# EAGLE schematic Phoenix_industries_95-134708-01 (EAGLE 8.3.2)
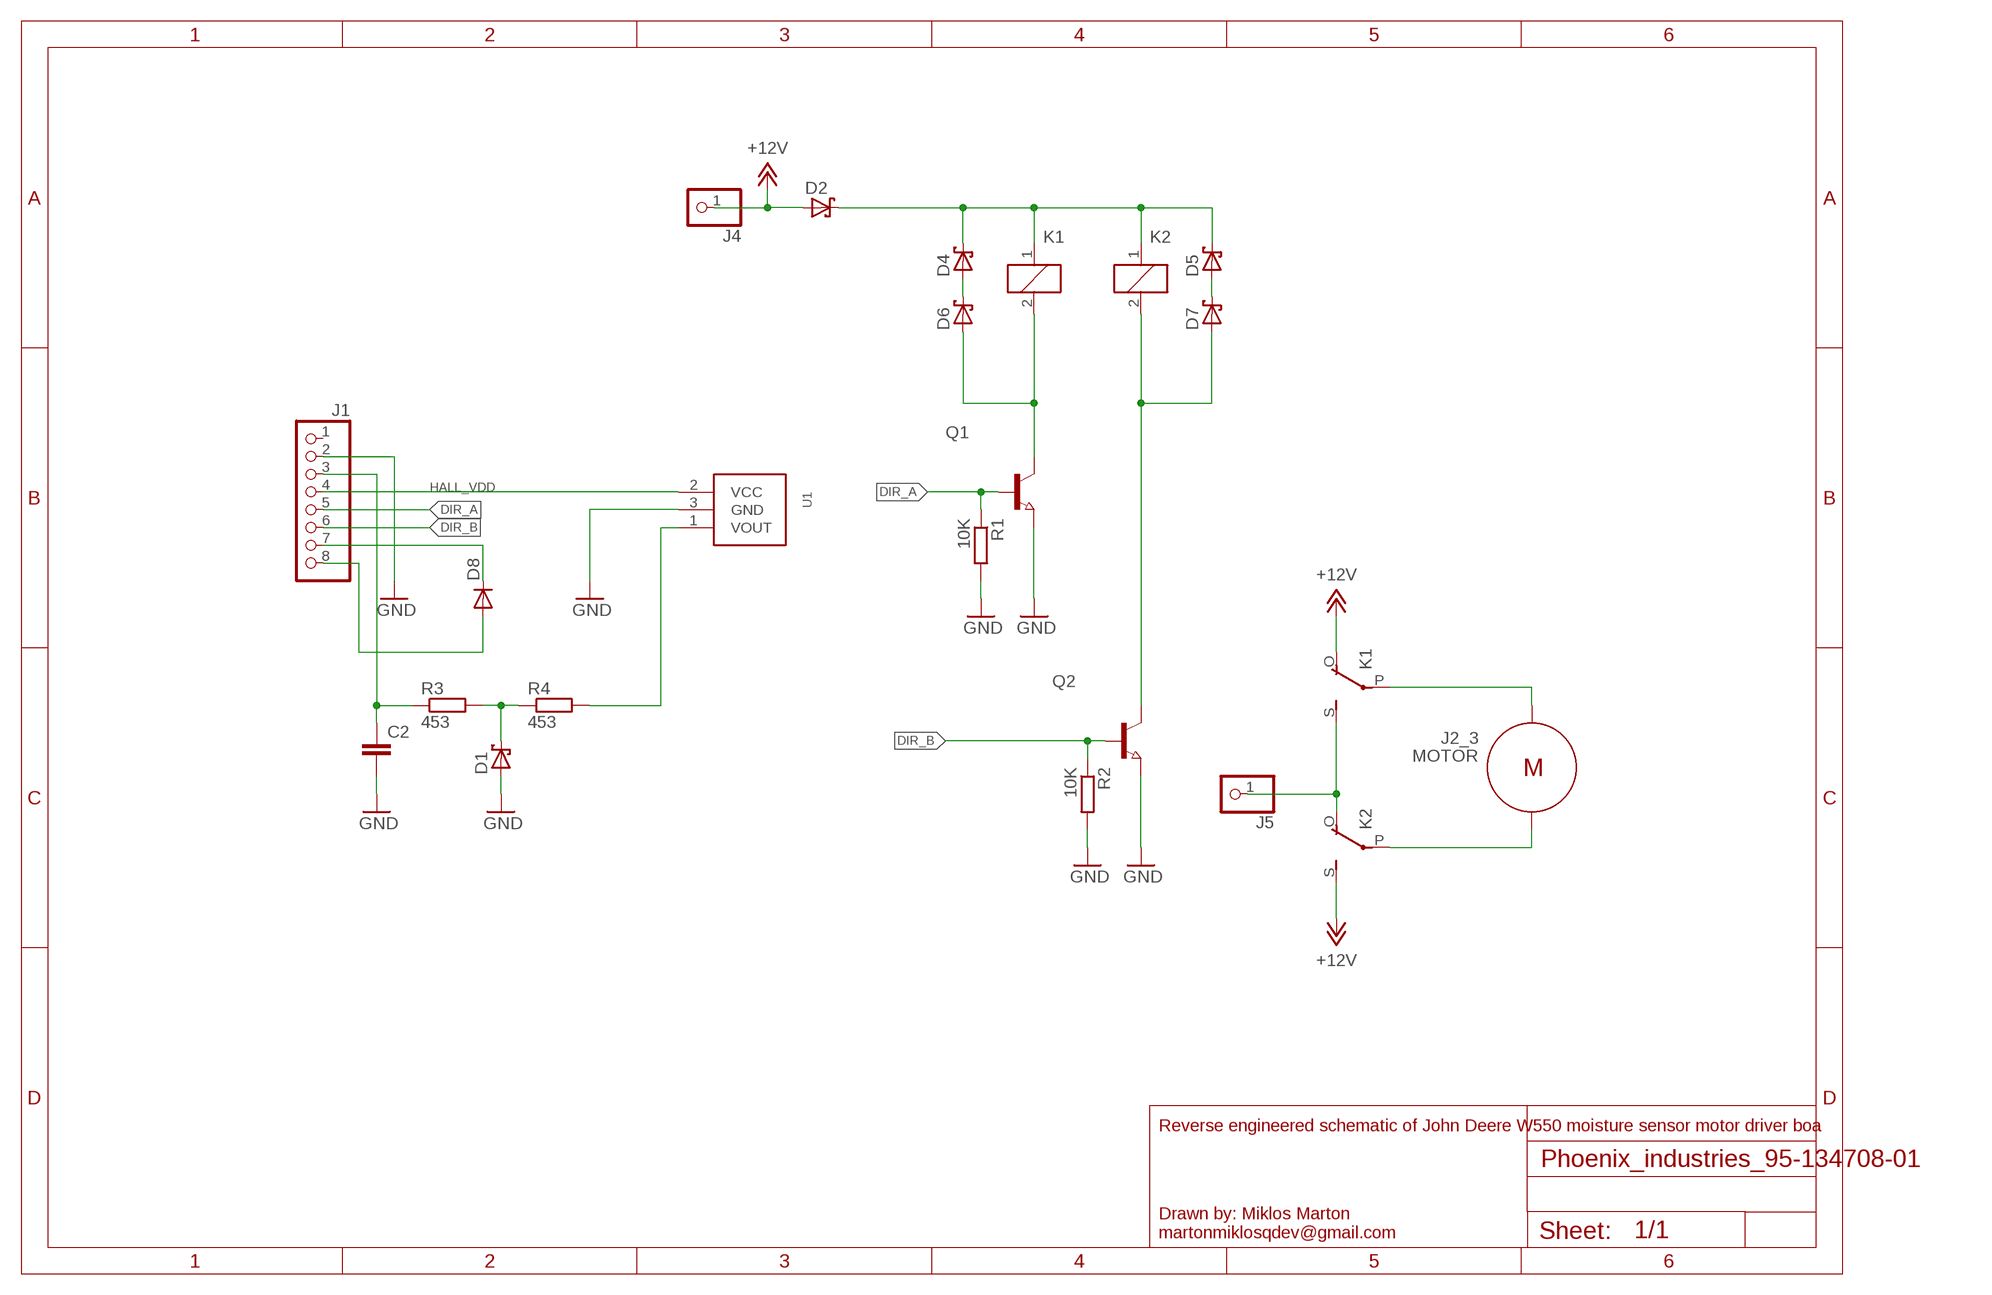
[diagram p0: schematic, sheet 1]

## Parts
C2  C-EUC0603  [C0603]
D1  SCHOTTKY-DIODESMD  [SMB]
D2  SCHOTTKY-DIODESMD  [SMB]
D4  SCHOTTKY-DIODESMD  [SMB]
D5  SCHOTTKY-DIODESMD  [SMB]
D6  SCHOTTKY-DIODESMD  [SMB]
D7  SCHOTTKY-DIODESMD  [SMB]
D8  SPARKFUN_DIODESOT23  [SPARKFUN_SOT23-3]
J1  PINHD-1X8  [1X08]
J2_3  MOTOR  (no package)
J4  PINHD-1X1  [1X01]
J5  PINHD-1X1  [1X01]
K1  E3206L  [E3206L]
K2  E3206L  [E3206L]
Q1  NPN-TRANSISTOR_SOT89  [SOT89]
Q2  NPN-TRANSISTOR_SOT89  [SOT89]
R1  10K  R-EU_R1206  [R1206]
R2  10K  R-EU_R1206  [R1206]
R3  453  R-EU_R1206  [R1206]
R4  453  R-EU_R1206  [R1206]
U1  SK1816SK1816-AE3-4-R  [SOT23]

## Nets
+12V: D2.A J4.1 K1.O(2:O) K2.S(2:S)
DIR_A: J1.5 Q1.1(B) R1.1
DIR_B: J1.6 Q2.1(B) R2.1
GND: C2.2 D1.A J1.2 Q1.3(E) Q2.3(E) R1.2 R2.2 U1.3(GND)
HALL_VDD: J1.4 U1.2(VCC)
N$1: D1.C R3.2 R4.1
N$2: R4.2 U1.1(VOUT)
N$3: C2.1 J1.3 R3.1
N$4: D7.A K2.2 Q2.2(C)
N$5: D2.C D4.C D5.C K1.1 K2.1
N$6: D5.A D7.C
N$7: D6.A K1.2 Q1.2(C)
N$8: D4.A D6.C
N$9: D8.3(C) J1.7
N$10: D8.1(A) J1.8
N$11: J5.1 K1.S(2:S) K2.O(2:O)
N$12: J2_3.1 K1.P(2:P)
N$13: J2_3.2 K2.P(2:P)
Unconnected: J1.1

## Library data of the parts
C2 = rcl:C-EU: CAPACITOR, European symbol
D1 D2 D4-D7 = diode:SCHOTTKY-DIODE: Schottky Diode
D8 = 3DR-GPS-LEA6-JST-v11-RELEASE:SPARKFUN_DIODE: Diode These are standard reverse protection diodes and small signal diodes. SMA package can handle up to about 1A. SOD-323 can handle about 200mA. What the SOD-323 package when ordering, there are some mfgs out there that are 5-pin packages.
J1 = pinhead:PINHD-1X8: PIN HEADER
J2_3 = symbols:MOTOR
J4 J5 = pinhead:PINHD-1X1: PIN HEADER
K1 K2 = relay:E3206L: RELAY 1 x switch, Eichhoff/distributor Schukat; OC_FARNELL: unknown; OC_NEWARK: unknown
Q1 Q2 = semicon-smd-ipc:NPN-TRANSISTOR_: NPN TRANSISTOR
R1-R4 = rcl:R-EU_: RESISTOR, European symbol
U1 = martonmiklos:SK1816: The UTC SK1816 is a semiconductor integrated circuit utilizing the Hall effect. It designed to operate in the alternating magnetic field especially at low supply voltage and operation over extended temperature ranges to +125°C. This Hall IC is suitable for application to various kinds of sensors, contact-less switches, such as Speed sensor, Position sensor, Rotation sensor, Contact-less sensor, and Motor control.